# EAGLE schematic p24fj256gb106 (EAGLE 6.1)
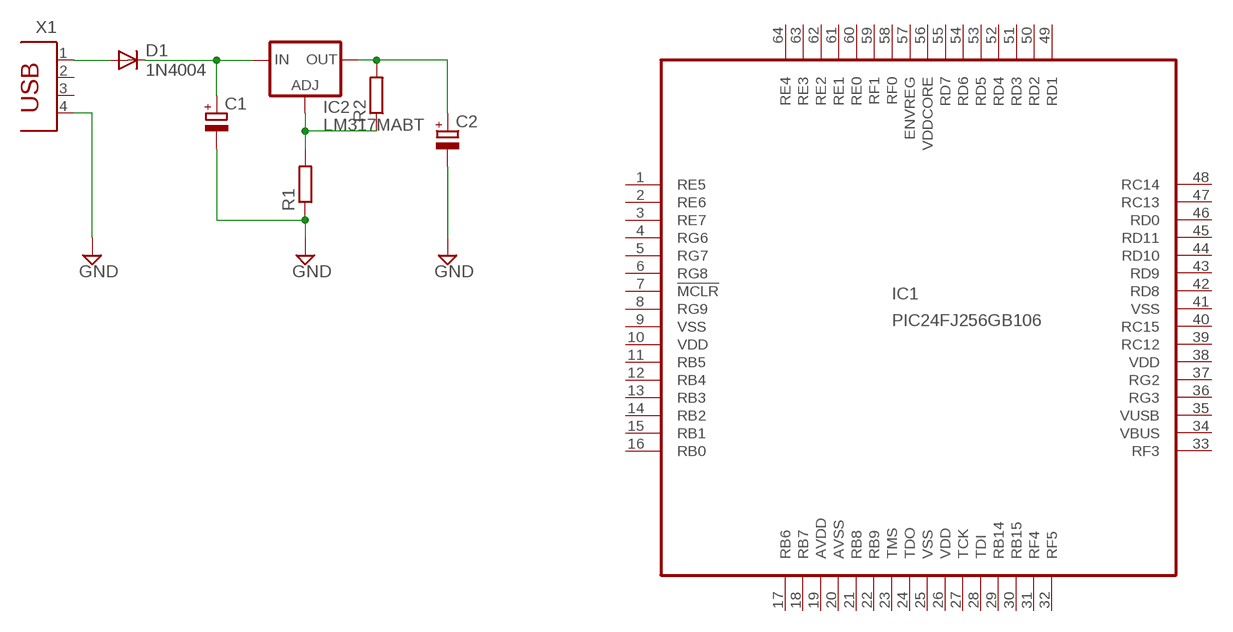
[diagram p0: schematic, sheet 1]

## Parts
C1  CPOL-EUSANYO_A'  [SANYO-OSCON_A']
C2  CPOL-EUSANYO_A'  [SANYO-OSCON_A']
D1  1N4004  [DO41-10]
IC1  PIC24FJ256GB106  [TQFP64-10X10]
IC2  LM317MABT  [TO220L1]
R1  R-EU_0204/5  [0204/5]
R2  R-EU_0204/5  [0204/5]
X1  PN61729  [PN61729]

## Nets
GND: C1.- C2.- R1.1 X1.4
N$1: C1.+ D1.C IC2.3(IN)
N$2: D1.A X1.1
N$3: IC2.1(ADJ) R1.2 R2.1
N$5: C2.+ IC2.2(OUT) R2.2
Unconnected: IC1.1(RE5) IC1.2(RE6) IC1.3(RE7) IC1.4(RG6) IC1.5(RG7) IC1.6(RG8) IC1.7(!MCLR) IC1.8(RG9) IC1.11(RB5) IC1.12(RB4) IC1.13(RB3) IC1.14(RB2) IC1.15(RB1) IC1.16(RB0) IC1.17(RB6) IC1.18(RB7) IC1.21(RB8) IC1.22(RB9) IC1.23(TMS) IC1.24(TDO) IC1.27(TCK) IC1.28(TDI) IC1.29(RB14) IC1.30(RB15) IC1.31(RF4) IC1.32(RF5) IC1.33(RF3) IC1.34(VBUS) IC1.35(VUSB) IC1.36(RG3) IC1.37(RG2) IC1.39(RC12) IC1.40(RC15) IC1.42(RD8) IC1.43(RD9) IC1.44(RD10) IC1.45(RD11) IC1.46(RD0) IC1.47(RC13) IC1.48(RC14) IC1.49(RD1) IC1.50(RD2) IC1.51(RD3) IC1.52(RD4) IC1.53(RD5) IC1.54(RD6) IC1.55(RD7) IC1.57(ENVREG) IC1.58(RF0) IC1.59(RF1) IC1.60(RE0) IC1.61(RE1) IC1.62(RE2) IC1.63(RE3) IC1.64(RE4) X1.2 X1.3

## Power pins joined to a net without a drawn wire
AVDD: IC1.19(AVDD)
AVSS: IC1.20(AVSS)
VDD: IC1.10(VDD) IC1.26(VDD) IC1.38(VDD)
VDDCORE: IC1.56(VDDCORE)
VSS: IC1.9(VSS) IC1.25(VSS) IC1.41(VSS)

## Library data of the parts
C1 C2 = rcl:CPOL-EU: POLARIZED CAPACITOR, European symbol
D1 = diode:1N4004: DIODE general purpose rectifier, 1 A
IC1 = microchip:PIC24FJ256GB106: PIC24FJ256GB106 edit this description Auto generated by make-symbol-device-package-bsdl.ulp Rev. 25 Source: PIC24FJ256GB106.bsd; MPN: PIC24FJ256GB106-I/PT; OC_FARNELL: 1576868; OC_NEWARK: 54M5129
IC2 = v-reg:LM317?*: 500 mA Adjustable Output Positive Voltage Regulator Source: http://www.onsemi.co.jp .. LM317M-D.PDF
R1 R2 = rcl:R-EU_: RESISTOR, European symbol
X1 = con-berg:PN61729: BERG USB connector; OC_FARNELL: unknown; OC_NEWARK: unknown